# Altium schematic sheet Main.SchDoc
size A4; SheetNumber: 1; SheetTotal: 2
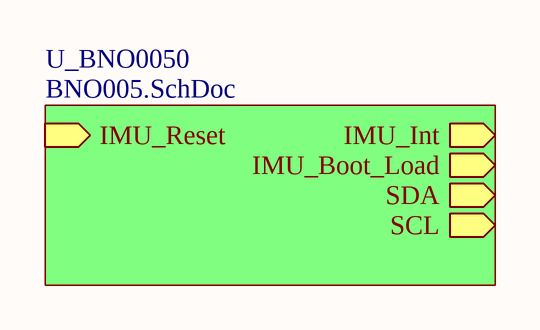
[diagram p0: Main.SchDoc]

## Sub-sheets
U_BNO0050 = BNO005.SchDoc: IMU_Reset (in), IMU_Int (out), IMU_Boot_Load (out), SDA (out), SCL (out)